# Altium schematic sheet TopLevel.SchDoc: Top-Level Schematic
size A3; Date: 10/18/2017; Author: Chase E Stewart; CompanyName: Three-Eyed Ravens; DrawnBy: Chase E Stewart; Organization: CU Boulder; DocumentNumber: 001; Revision: 1.1; SheetNumber: 1; SheetTotal: 8; Application_BuildNumber: 1.0
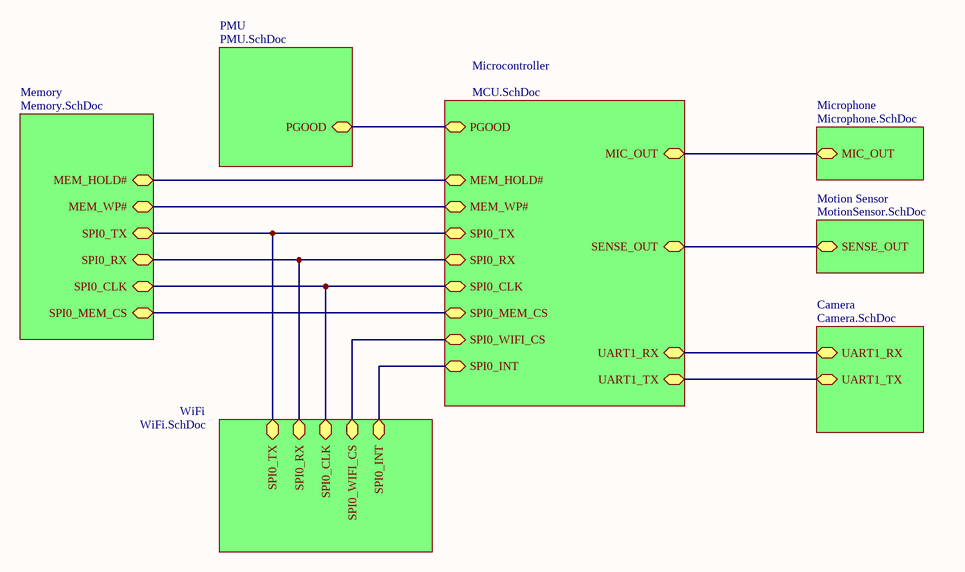
[diagram p0: TopLevel.SchDoc]

## Sub-sheets
Camera = Camera.SchDoc: UART1_RX, UART1_TX
Memory = Memory.SchDoc: SPI0_RX, SPI0_CLK, SPI0_MEM_CS, SPI0_TX, MEM_WP#, MEM_HOLD#
Microcontroller = MCU.SchDoc: UART1_RX, UART1_TX, MIC_OUT, SENSE_OUT, SPI0_WIFI_CS, SPI0_MEM_CS, SPI0_CLK, SPI0_RX, SPI0_TX, MEM_WP#, MEM_HOLD#, SPI0_INT, PGOOD
Microphone = Microphone.SchDoc: MIC_OUT
Motion Sensor = MotionSensor.SchDoc: SENSE_OUT
PMU = PMU.SchDoc: PGOOD
WiFi = WiFi.SchDoc: SPI0_TX, SPI0_RX, SPI0_CLK, SPI0_WIFI_CS, SPI0_INT

## Nets
(unnamed): sheet Microcontroller/UART1_RX, sheet Camera/UART1_RX
(unnamed): sheet Microcontroller/UART1_TX, sheet Camera/UART1_TX
(unnamed): sheet Microcontroller/MIC_OUT, sheet Microphone/MIC_OUT
(unnamed): sheet Microcontroller/SENSE_OUT, sheet Motion Sensor/SENSE_OUT
(unnamed): sheet Microcontroller/SPI0_WIFI_CS, sheet WiFi/SPI0_WIFI_CS
(unnamed): sheet Microcontroller/SPI0_MEM_CS, sheet Memory/SPI0_MEM_CS
(unnamed): sheet Microcontroller/SPI0_CLK, sheet Memory/SPI0_CLK, sheet WiFi/SPI0_CLK
(unnamed): sheet Microcontroller/SPI0_RX, sheet Memory/SPI0_RX, sheet WiFi/SPI0_RX
(unnamed): sheet Microcontroller/SPI0_TX, sheet Memory/SPI0_TX, sheet WiFi/SPI0_TX
(unnamed): sheet Microcontroller/MEM_WP#, sheet Memory/MEM_WP#
(unnamed): sheet Microcontroller/MEM_HOLD#, sheet Memory/MEM_HOLD#
(unnamed): sheet Microcontroller/SPI0_INT, sheet WiFi/SPI0_INT
(unnamed): sheet Microcontroller/PGOOD, sheet PMU/PGOOD

## Notes on the sheet
- Title
- Size:
- Date:
- A3
- Number:
- Time:
- Revision:
- Sheet
- of
- File: